# Altium project LifeLine.PrjPcb (part 1 of 2)
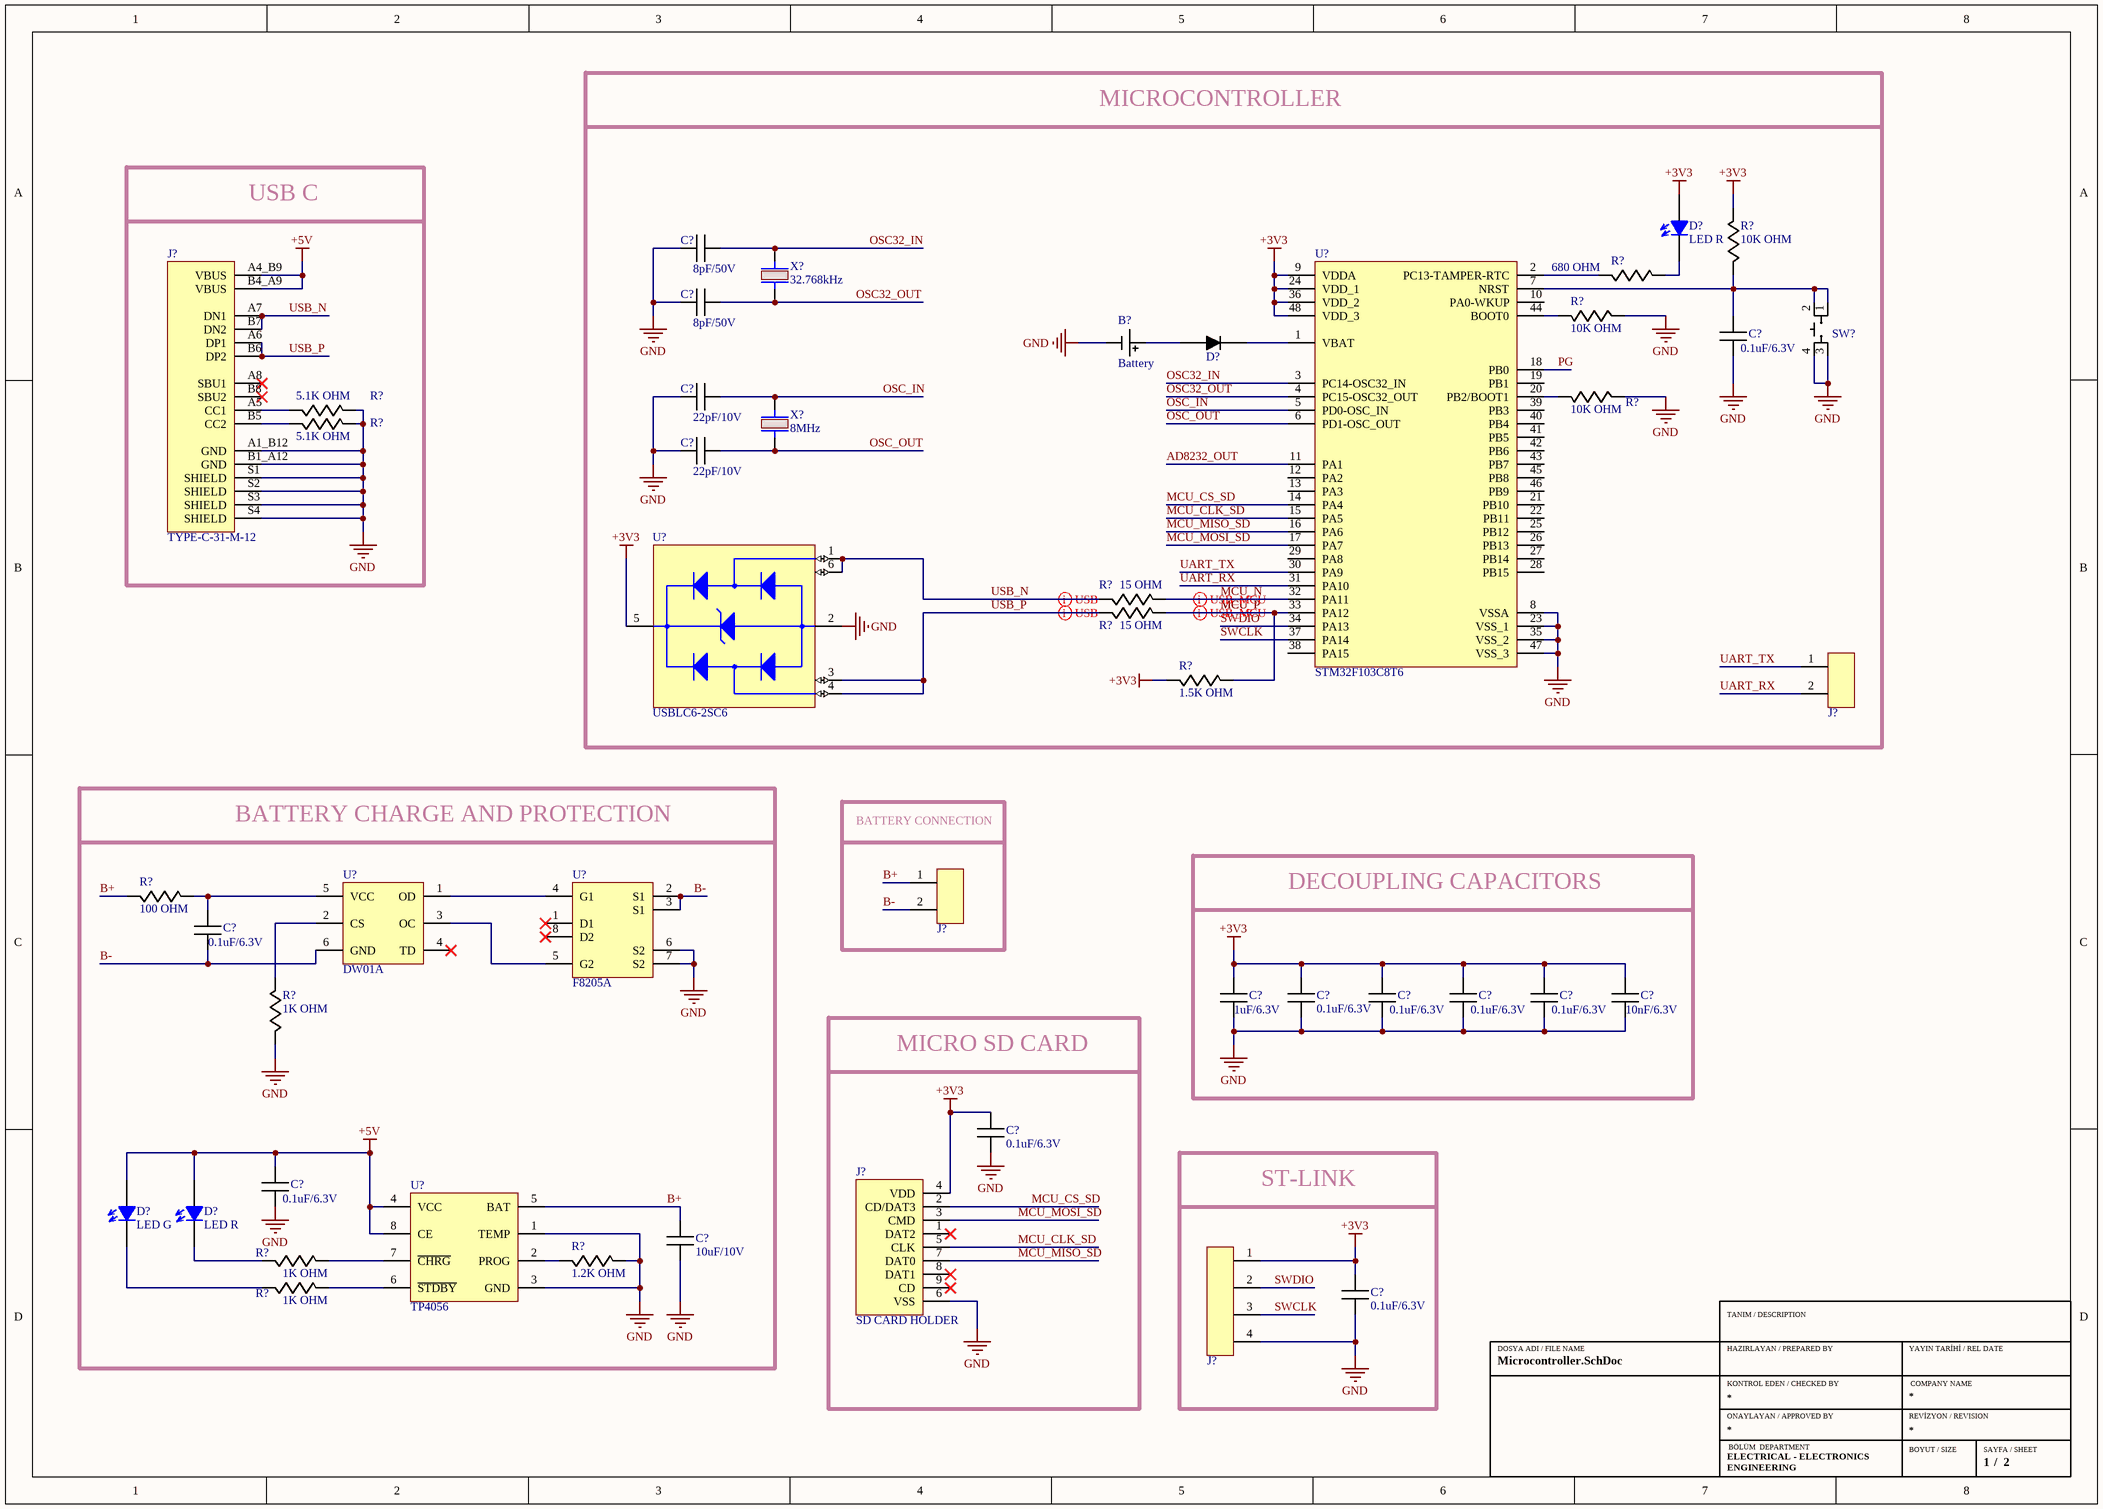
[diagram p0: Microcontroller.SchDoc]
2 sheets, 93 parts. Net scope: global (net labels, ports and power ports of the same name join across sheets).
Sheets:
  Microcontroller.SchDoc
  AD8232.SchDoc

## Sheet Microcontroller.SchDoc
size A3; SheetNumber: 1; SheetTotal: 2

### Parts
(Parts that share a designator on the sheet are numbered #1, #2 ... from top to bottom, then left to right.)
B?  Battery  [2032]
C?#1  8pF/50V  [CAP_0603]
C?#2  8pF/50V  [CAP_0603]
C?#3  0.1uF/6.3V  [CAP_0603]
C?#4  22pF/10V  [CAP 0805]
C?#5  22pF/10V  [CAP 0805]
C?#6  0.1uF/6.3V  [CAP_0603]
C?#7  1uF/6.3V  [CAP_0603]
C?#8  0.1uF/6.3V  [CAP_0603]
C?#9  0.1uF/6.3V  [CAP_0603]
C?#10  0.1uF/6.3V  [CAP_0603]
C?#11  0.1uF/6.3V  [CAP_0603]
C?#12  10nF/6.3V  [CAP_0603]
C?#13  0.1uF/6.3V  [CAP_0603]
C?#14  0.1uF/6.3V  [CAP_0603]
C?#15  10uF/10V  [CAP_0603]
C?#16  0.1uF/6.3V  [CAP_0603]
D?#1  LED R  [LED_RED_0805]
D?#2  DIODE SCHOTTKY 40V 1A SOD123  [SOD 123]  (value not drawn)
D?#3  LED G  [LED_GREEN_0805]
D?#4  LED R  [LED_RED_0805]
J?#1  TYPE-C-31-M-12  [USB]
J?#2  B2B-PH-SM4-TBT  [JST-2]  (value not drawn)
J?#3  BH-18650-PC  [1S BATTERY HOLDER]  (value not drawn)
J?#4  SD CARD HOLDER  [MICROSD - TF-115Y]
J?#5  4 Position Receptacle Connector 0.100" (2.54mm) Through Hole Gold  [HEADER X4]  (value not drawn)
R?#1  680 OHM  [RES_0603]
R?#2  10K OHM  [RES_0603]
R?#3  10K OHM  [RES_0603]
R?#4  10K OHM  [RES_0603]
R?#5  5.1K OHM  [RES 0805]
R?#6  5.1K OHM  [RES 0805]
R?#7  15 OHM  [RES 0805]
R?#8  15 OHM  [RES 0805]
R?#9  1.5K OHM  [RES_0603]
R?#10  100 OHM  [RES 0805]
R?#11  1K OHM  [RES 0805]
R?#12  1K OHM  [RES 0805]
R?#13  1.2K OHM  [RES 0805]
R?#14  1K OHM  [RES 0805]
SW?  TL3305BF260QG  [BUTTON]  (value not drawn)
U?#1  STM32F103C8T6  [LQFP48]
U?#2  USBLC6-2SC6  [SOT23-6]
U?#3  DW01A  [SOT23-6]
U?#4  F8205A  [TSSOP 8]
U?#5  TP4056  [ESOP-8]
X?#1  32.768kHz  [ABS07]
X?#2  8MHz  [ABLS]

### Blocks framed on the sheet
MICROCONTROLLER: B? C?#1-C?#5 D?#1 D?#2 J?#2 R?#1-R?#4 R?#7-R?#9 SW? U?#1 U?#2 X?#1 X?#2
USB C: J?#1 R?#5 R?#6
BATTERY CHARGE AND PROTECTION: C?#6 C?#14 C?#15 D?#3 D?#4 R?#10-R?#14 U?#3-U?#5
BATTERY CONNECTION: J?#3
DECOUPLING CAPACITORS: C?#7-C?#12
MICRO SD CARD: C?#13 J?#4
ST-LINK: C?#16 J?#5

### Nets
+3V3: C?#7.2 C?#8.2 C?#9.2 C?#10.2 C?#11.2 C?#12.2 C?#13.2 C?#16.2 D?#1.2 J?#4.4(VDD) J?#5.1 R?#2.2 R?#9.1 U?#1.9(VDDA) U?#1.24(VDD_1) U?#1.36(VDD_2) U?#1.48(VDD_3) U?#2.5(VBUS)
+5V: C?#14.2 D?#3.2 D?#4.2 J?#1.A4_B9(VBUS) J?#1.B4_A9(VBUS) U?#5.4(VCC) U?#5.8(CE)
GND: B?.2(-) C?#1.1 C?#2.1 C?#3.1 C?#4.2 C?#5.2 C?#7.1 C?#8.1 C?#9.1 C?#10.1 C?#11.1 C?#12.1 C?#13.1 C?#14.1 C?#15.1 C?#16.1 J?#1.A1_B12(GND) J?#1.B1_A12(GND) J?#1.S1(SHIELD) J?#1.S2(SHIELD) J?#1.S3(SHIELD) J?#1.S4(SHIELD) J?#4.6(VSS) J?#5.4 R?#3.1 R?#4.1 R?#5.2 R?#6.2 R?#11.1 R?#13.2 SW?.3 SW?.4 U?#1.8(VSSA) U?#1.23(VSS_1) U?#1.35(VSS_2) U?#1.47(VSS_3) U?#2.2(GND) U?#4.6(S2) U?#4.7(S2) U?#5.1(TEMP) U?#5.3(GND)
AD8232_OUT: U?#1.11(PA1)
B+: C?#15.2 J?#3.1 R?#10.1 U?#5.5(BAT)
B-: C?#6.2 J?#3.2 U?#3.6(GND) U?#4.2(S1) U?#4.3(S1)
MCU_CLK_SD: J?#4.5(CLK) U?#1.15(PA5)
MCU_CS_SD: J?#4.2(CD/DAT3) U?#1.14(PA4)
MCU_MISO_SD: J?#4.7(DAT0) U?#1.16(PA6)
MCU_MOSI_SD: J?#4.3(CMD) U?#1.17(PA7)
MCU_N: R?#7.2 U?#1.32(PA11)
MCU_P: R?#8.2 R?#9.2 U?#1.33(PA12)
OSC32_IN: C?#1.2 U?#1.3(PC14-OSC32_IN) X?#1.2
OSC32_OUT: C?#2.2 U?#1.4(PC15-OSC32_OUT) X?#1.1
OSC_IN: C?#4.1 U?#1.5(PD0-OSC_IN) X?#2.2
OSC_OUT: C?#5.1 U?#1.6(PD1-OSC_OUT) X?#2.1
PG: U?#1.18(PB0)
SWCLK: J?#5.3 U?#1.37(PA14)
SWDIO: J?#5.2 U?#1.34(PA13)
UART_RX: J?#2.2 U?#1.31(PA10)
UART_TX: J?#2.1 U?#1.30(PA9)
USB_N: J?#1.A7(DN1) J?#1.B7(DN2) R?#7.1 U?#2.1(I/O1_IN) U?#2.6(I/O1_OUT)
USB_P: J?#1.A6(DP1) J?#1.B6(DP2) R?#8.1 U?#2.3(I/O2_IN) U?#2.4(I/O2_OUT)
NetB?_1: B?.1(+) D?#2.A
NetC?#3_2: C?#3.2 R?#2.1 SW?.1 SW?.2 U?#1.7(NRST)
NetC?#6_1: C?#6.1 R?#10.2 U?#3.5(VCC)
NetD?#1_1: D?#1.1 R?#1.2
NetD?#2_C: D?#2.C U?#1.1(VBAT)
NetD?#3_1: D?#3.1 R?#14.1
NetD?#4_1: D?#4.1 R?#12.1
NetJ?#1_A5: J?#1.A5(CC1) R?#5.1
NetJ?#1_B5: J?#1.B5(CC2) R?#6.1
NetR?#1_1: R?#1.1 U?#1.2(PC13-TAMPER-RTC)
NetR?#3_2: R?#3.2 U?#1.44(BOOT0)
NetR?#4_2: R?#4.2 U?#1.20(PB2/BOOT1)
NetR?#11_2: R?#11.2 U?#3.2(CS)
NetR?#12_2: R?#12.2 U?#5.7(~{CHRG})
NetR?#13_1: R?#13.1 U?#5.2(PROG)
NetR?#14_2: R?#14.2 U?#5.6(~{STDBY})
NetU?#3_1: U?#3.1(OD) U?#4.4(G1)
NetU?#3_3: U?#3.3(OC) U?#4.5(G2)

Not connected (* = marked no-connect by the designer): J?#1 A8(SBU1)* B8(SBU2)*; J?#4 1(DAT2)* 8(DAT1)* 9(CD)*; U?#1 10(PA0-WKUP) 12(PA2) 13(PA3) 19(PB1) 21(PB10) 22(PB11) 25(PB12) 26(PB13) 27(PB14) 28(PB15) 29(PA8) 38(PA15) 39(PB3) 40(PB4) 41(PB5) 42(PB6) 43(PB7) 45(PB8) 46(PB9); U?#3 4(TD)*; U?#4 1(D1)* 8(D2)*

### Layout directives
differential pair: MCU_N, MCU_P, USB_N, USB_P

### Notes on the sheet
- TANIM / DESCRIPTION
- DOSYA ADI / FILE NAME
- HAZIRLAYAN / PREPARED BY
- KONTROL EDEN / CHECKED BY
- YAYIN TARİHİ / REL DATE
- COMPANY NAME
- ONAYLAYAN / APPROVED BY
- ELECTRICAL - ELECTRONICS
- BÖLÜM  DEPARTMENT
- BOYUT / SIZE
- REVİZYON / REVISION
- SAYFA / SHEET
- ENGINEERING
- /

### Library data of the parts
B? = Battery Holder: BATTERY HOLDER COIN 20MM SMD / Battery Holder (Open) Coin, 20.0mm 1 Cell SMD (SMT) Tab; ComponentLink1Description: datasheet; ComponentLink1URL: https://www.memoryprotectiondevices.com/datasheets/BU2032SM-JJ-MINI-GTR/BU2032SM-JJ-MINI-GTR-datasheet.pdf
C?#1 C?#2 = CAP CER 8pF: Multilayer Ceramic Capacitor, 8 pF, 50 V, ï¿½ 0.5 pF, C0G (NP0), 0603 [1608 Metric]; Manufacturer: Yageo; Manufacturer Part Number: CC0603DRNPO9BN8R0; Capacitance: 8pF; Voltage Rating: 50V; Supplier 1: Arrow Electronics; RoHS: Yes; Category: Ceramic Capacitors; Stock 1: 160000; Pricing 1: 4000=0,0112, 8000=0,01, 12000=0,0099, 28000=0,0093, 40000=0,0088, 100000=0,0087, 200000=0,0082, 400000=0,0079 (USD); Mount: Surface Mount; Case/Package: 0603; Case Code (Metric): 1608; Case Code (Imperial): 0603; Min Operating Temperature: -55°C; Max Operating Temperature: 125°C; Packaging: Tape and Reel; Package Quantity: 1; Voltage Rating (DC): 50V; Dielectric: C0G; Termination: SMD/SMT; Series: CC; Construction: Flat; Length: 1.6mm; Width: 0.031inch; Height: 0.8mm; Thickness: 0.035inch; RoHS Compliant: Yes; Halogen Free: 5694HalogenFree; Lead Free: 5697LeadFree; ComponentLink1URL: https://datasheet.ciiva.com/145/mlccorderingcode-145150.pdf?src-supplier=Digikey; ComponentLink1Description: https://datasheet.ciiva.com/145/mlccorderingcode-145150.pdf?src-supplier=Digikey; ComponentLink2URL: https://datasheet.ciiva.com/145/mlccorderingcode-145149.pdf?src-supplier=Digikey; ComponentLink2Description: https://datasheet.ciiva.com/145/mlccorderingcode-145149.pdf?src-supplier=Digikey; ComponentLink3URL: https://datasheet.ciiva.com/145/mlccorderingcode-145151.pdf?src-supplier=Digikey; ComponentLink3Description: https://datasheet.ciiva.com/145/mlccorderingcode-145151.pdf?src-supplier=Digikey; ComponentLink4URL: https://datasheet.ciiva.com/13386/upy-gp-np0-16v-to-50v-8-13386318.pdf?src-supplier=Mouser; ComponentLink4Description: https://datasheet.ciiva.com/13386/upy-gp-np0-16v-to-50v-8-13386318.pdf?src-supplier=Mouser; Supplier Part Number 1: CC0603DRNPO9BN8R0
C?#3 C?#6 C?#8-C?#11 C?#13 C?#14 C?#16 = CAP CER 0.1uF: Capacitor, Ceramic, 100Nf, 6.3Vdc, 10-% Tol, 10+% Tol, X7r-Tc Code, -15, 15%-Tc Rohs Compliant: Yes; Manufacturer: KEMET; Manufacturer Part Number: C0603C104K9RACTU; Dielectric Material: 4241ConductorMaterial; Voltage Rating: 6.3V; Tolerance: 10%; Dielectric: X7R; Dissipation Factor: 5%; Supplier 1: Digikey; RoHS: Yes; Category: Ceramic Capacitors; Stock 1: 82215; Pricing 1: 1=0,11, 10=0,066, 100=0,0429, 1000=0,0305 (USD); Mount: Surface Mount; Case/Package: 0603; Case Code (Imperial): 0603; Case Code (Metric): 1608; Material: 4241ConductorMaterial; Min Operating Temperature: -55°C; Max Operating Temperature: 125°C; Capacitance: 100nF; Package Quantity: 4000; Packaging: Tape and Reel; Voltage Rating (DC): 6.3V; Termination: SMD/SMT; Series: C; Construction: Flat; Length: 1.6mm; Width: 0.8mm; Height: 0.8mm; Thickness: 0.034inch; Depth: 0.8mm; Radiation Hardening: No; RoHS Compliant: Yes; ComponentLink1URL: https://datasheet.ciiva.com/13371/kem-c1002-x7r-smd-357932-13371879.pdf?src-supplier=Mouser; ComponentLink1Description: https://datasheet.ciiva.com/13371/kem-c1002-x7r-smd-357932-13371879.pdf?src-supplier=Mouser; Supplier Part Number 1: 399-15351-1-ND
C?#4 C?#5 = CAP CER 22pF: Cap Ceramic 22pF 10V C0G 5% Pad SMD 0805 125C T/R; Manufacturer: Wurth Electronics; Manufacturer Part Number: 885012007002; Insulation Resistance: 10GR; Supplier 1: Mouser; RoHS: Yes; Category: Ceramic Capacitors; Stock 1: 11792; Pricing 1: 1=0,1, 10=0,053, 50=0,053, 100=0,046, 1000=0,041, 10000=0,034 (USD); Voltage Rating (DC): 10V; Height: 600um; ComponentLink1URL: http://www.farnell.com/datasheets/2031682.pdf?src-supplier=Farnell; ComponentLink1Description: http://www.farnell.com/datasheets/2031682.pdf?src-supplier=Farnell; ComponentLink2URL: https://katalog.we-online.de/pbs/datasheet/885012007002.pdf?src-supplier=Digikey; ComponentLink2Description: https://katalog.we-online.de/pbs/datasheet/885012007002.pdf?src-supplier=Digikey; Supplier Part Number 1: 710-885012007002
C?#7 = CAP CER 1uF: Multilayer Ceramic Capacitor, 1 uF, 6.3 V, ± 10%, X5R, 0603 [1608 Metric]; Manufacturer: KEMET; Manufacturer Part Number: C0603C105K9PAC7411; Capacitance: 1uF; Voltage Rating (DC): 6.3V; Supplier 1: Arrow Electronics; RoHS: Yes; Category: Ceramic Capacitors; Stock 1: 10; Pricing 1: 1=0,043, 10=0,0049 (USD); Mount: Surface Mount; Case/Package: 0603; Dielectric Material: Ceramic; Min Operating Temperature: -55°C; Max Operating Temperature: 85°C; Tolerance: 10%; Packaging: Tape and Reel; Dielectric: X5R; Construction: Flat; Series: SMD Comm X5R; Voltage Rating: 6.3V; Length: 1.6mm; Height: 0.8mm; Depth: 0.8mm; Radiation Hardening: No; Lead Free: Lead Free; RoHS Compliant: Yes; ComponentLink1URL: http://capacitoredge.kemet.com/capedge2/DataSheet?pn=C0603C105K9PAC7411&src-supplier=Avnet; ComponentLink1Description: http://capacitoredge.kemet.com/capedge2/DataSheet?pn=C0603C105K9PAC7411&src-supplier=Avnet; Supplier Part Number 1: C0603C105K9PAC7411
C?#12 = CAP CER 10nF: Capacitor, Ceramic, 10Nf, 6.3Vdc, 10-% Tol, 10+% Tol, X7r-Tc Code, -15, 15%-Tc Rohs Compliant: Yes; Manufacturer: KEMET; Manufacturer Part Number: C0603C103K9RACTU; Tolerance: 10%; Voltage Rating: 6.3V; Dielectric: X7R; Dissipation Factor: 5%; Supplier 1: Digikey; RoHS: Yes; Category: Ceramic Capacitors; Stock 1: 43180; Pricing 1: 1=0,1, 10=0,048, 100=0,0311, 1000=0,02155 (USD); Mount: Surface Mount; Case/Package: 0603; Case Code (Metric): 1608; Case Code (Imperial): 0603; Dielectric Material: Ceramic; Material: Ceramic; Min Operating Temperature: -55°C; Max Operating Temperature: 125°C; Capacitance: 10nF; Package Quantity: 1; Packaging: Tape and Reel; Voltage Rating (DC): 6.3V; Termination: SMD/SMT; Series: C; Construction: Flat; Length: 1.6mm; Width: 0.031inch; Height: 0.8mm; Thickness: 0.034inch; Depth: 0.8mm; Radiation Hardening: No; RoHS Compliant: Yes; ComponentLink1URL: https://datasheet.ciiva.com/5421/kem-c1002-x7r-smd-357932-5421815.pdf?src-supplier=Mouser; ComponentLink1Description: https://datasheet.ciiva.com/5421/kem-c1002-x7r-smd-357932-5421815.pdf?src-supplier=Mouser; Supplier Part Number 1: 399-C0603C103K9RACTUDKR-ND
C?#15 = CAP CER 10uF: Multilayer Ceramic Capacitor, 10 uF, 10 V, ï¿½ 20%, X5R, 0603 [1608 Metric]; Manufacturer: Murata; Manufacturer Part Number: GRM188R61A106ME69D; Capacitance: 10uF; Voltage Rating: 10V; Supplier 1: Digikey; RoHS: Yes; Category: Ceramic Capacitors; Stock 1: 92548; Pricing 1: 1=0,12, 10=0,068, 100=0,0409, 1000=0,02707 (USD); Mount: Surface Mount; Case/Package: 0603; Number of Pins: 2NUMBER; Case Code (Metric): 1608; Case Code (Imperial): 0603; Material: Ceramic; Weight: 0.000222oz; Min Operating Temperature: -55°C; Max Operating Temperature: 85°C; Packaging: Tape and Reel; Tolerance: 20%; Dielectric: X5R; Termination: SMD/SMT; Voltage Rating (DC): 10V; Package Quantity: 4000; Series: GRM; Length: 1.6mm; Width: 0.8mm; Height: 0.8mm; Thickness: 0.035inch; Lead Free: Lead Free; RoHS Compliant: Yes; Reach SVHC Compliant: Unknown; ComponentLink1URL: http://www.farnell.com/datasheets/1872210.pdf?src-supplier=Farnell; ComponentLink1Description: http://www.farnell.com/datasheets/1872210.pdf?src-supplier=Farnell; ComponentLink2URL: http://www.mouser.com/ds/2/281/c02e-2905.pdf?src-supplier=Mouser; ComponentLink2Description: http://www.mouser.com/ds/2/281/c02e-2905.pdf?src-supplier=Mouser; ComponentLink3URL: http://www.farnell.com/datasheets/1872210.pdf?src-supplier=Newark; ComponentLink3Description: http://www.farnell.com/datasheets/1872210.pdf?src-supplier=Newark; ComponentLink4URL: https://datasheet.octopart.com/GRM188R61A106ME69D-Murata-datasheet-22122223.pdf?src-supplier=Future+Electronics; ComponentLink4Description: https://datasheet.octopart.com/GRM188R61A106ME69D-Murata-datasheet-22122223.pdf?src-supplier=Future+Electronics; ComponentLink5URL: http://search.murata.co.jp/Ceramy/image/img/A01X/G101/ENG/GRM188R61A106ME69-01.pdf?src-supplier=Digikey; ComponentLink5Description: http://search.murata.co.jp/Ceramy/image/img/A01X/G101/ENG/GRM188R61A106ME69-01.pdf?src-supplier=Digikey; ComponentLink6URL: http://www.farnell.com/datasheets/2048014.pdf?src-supplier=Element14; ComponentLink6Description: http://www.farnell.com/datasheets/2048014.pdf?src-supplier=Element14; ComponentLink7URL: https://datasheet.octopart.com/GRM188R61A106ME69D-Murata-datasheet-62317187.pdf?src-supplier=Element14; ComponentLink7Description: https://datasheet.octopart.com/GRM188R61A106ME69D-Murata-datasheet-62317187.pdf?src-supplier=Element14; ComponentLink8URL: http://www.farnell.com/datasheets/1872210.pdf?src-supplier=Element14; ComponentLink8Description: http://www.farnell.com/datasheets/1872210.pdf?src-supplier=Element14; ComponentLink9URL: https://datasheet.octopart.com/GRM188R61A106ME69D-Murata-datasheet-165579666.pdf?src-supplier=TME; ComponentLink9Description: https://datasheet.octopart.com/GRM188R61A106ME69D-Murata-datasheet-165579666.pdf?src-supplier=TME; Supplier Part Number 1: 490-10475-1-ND
D?#1 D?#4 = LED RED 0805: Led, Red, 630 Nm, 1.9 V, 30 Ma, 60 Mcd Rohs Compliant: Yes |Wurth Elektronik 150080SS75000; Manufacturer: Wurth Electronics; Lens Color: Colorless; Luminous Intensity: 60mcd; Forward Current: 30mA; Forward Voltage: 1.9V; Viewing Angle: 140°; Wavelength: 630nm; Lens Style: Clear,Flat,Rectangular; Test Current: 20mA; Lens Transparency: Clear; Max Reverse Voltage (DC): 5V; Power Dissipation: 72mW; Lens Size: 1.25mm; Supplier 1: Mouser; Manufacturer Part Number: 150080SS75000; RoHS: Yes; Category: LEDs; Stock 1: 9598; Pricing 1: 1=0,19, 10=0,187, 50=0,176, 100=0,151, 1000=0,138, 10000=0,138 (USD); Mount: Surface Mount; Case/Package: 0805; Color: Red; Case Code (Metric): 2012; Case Code (Imperial): 0805; Min Operating Temperature: -40°C; Max Operating Temperature: 85°C; Package Quantity: 1; Packaging: Cut Tape; Dominant Wavelength: 630nm; Series: WL-SMCW; Reverse Voltage: 5V; Length: 2mm; Width: 1.25mm; Height: 0.8mm; RoHS Compliant: Yes; Reach SVHC Compliant: Unknown; ComponentLink1URL: https://datasheet.ciiva.com/22656/150080ss75000-22656963.pdf?src-supplier=Element14; ComponentLink1Description: https://datasheet.ciiva.com/22656/150080ss75000-22656963.pdf?src-supplier=Element14; ComponentLink2URL: https://datasheet.ciiva.com/29279/759436-da-01-en-chipled-0805-w-kl-s-rot-150080ss75000-29279211.pdf?src-supplier=Conrad; ComponentLink2Description: https://datasheet.ciiva.com/29279/759436-da-01-en-chipled-0805-w-kl-s-rot-150080ss75000-29279211.pdf?src-supplier=Conrad; ComponentLink3URL: https://datasheet.ciiva.com/29563/150080ss75000-29563014.pdf?src-supplier=Digikey; ComponentLink3Description: https://datasheet.ciiva.com/29563/150080ss75000-29563014.pdf?src-supplier=Digikey; ComponentLink4URL: https://datasheet.ciiva.com/29563/150080ss75000-29563013.pdf?src-supplier=Digikey; ComponentLink4Description: https://datasheet.ciiva.com/29563/150080ss75000-29563013.pdf?src-supplier=Digikey; ComponentLink5URL: https://datasheet.ciiva.com/29563/150080ss75000-29563015.pdf?src-supplier=Digikey; ComponentLink5Description: https://datasheet.ciiva.com/29563/150080ss75000-29563015.pdf?src-supplier=Digikey; Supplier Part Number 1: 710-150080SS75000
D?#2 = DIODE SCHOTTKY 40V 1A: 1N5819HW Series 40 V 1 A Surface Mount Schottky Barrier Rectifier - SOD-123; Manufacturer: Diodes; Manufacturer Part Number: 1N5819HW-7-F; Max Reverse Current: 50uA; Max Forward Surge Current (Ifsm): 25A; Forward Voltage: 450mV; Max Power Dissipation: 450mW; Polarity: Standard; Capacitance: 50pF; Supplier 1: Arrow Electronics; RoHS: Yes; Category: Schottky Diodes; Stock 1: 1971000; Pricing 1: 3000=0,0529, 6000=0,0453, 9000=0,0417 (USD); Case/Package: SOD-123-2; Number of Pins: 2; Weight: 0.000353oz; Min Operating Temperature: -65°C; Max Operating Temperature: 125°C; Forward Current: 1A; Max Repetitive Reverse Voltage (Vrrm): 40V; Packaging: Tape and Reel; Peak Non-Repetitive Surge Current: 25A; Package Quantity: 3000; Average Rectified Current: 1A; Termination: SMD/SMT; Voltage Rating (DC): 40V; Current Rating: 1A; Output Current: 1A; Max Reverse Voltage (DC): 40V; Series: -; Reverse Voltage: 40V; Length: 2.85mm; Width: 1.7mm; Height: 1.25mm; Radiation Hardening: No; RoHS Compliant: Yes; Reach SVHC Compliant: No; Lead Free: Lead Free; ComponentLink1URL: https://datasheet.ciiva.com/27092/1538419-27092484.pdf?src-supplier=Jameco; ComponentLink1Description: https://datasheet.ciiva.com/27092/1538419-27092484.pdf?src-supplier=Jameco; ComponentLink2URL: https://datasheet.ciiva.com/16303/ds30217-16303296.pdf?src-supplier=Future+Electronics; ComponentLink2Description: https://datasheet.ciiva.com/16303/ds30217-16303296.pdf?src-supplier=Future+Electronics; ComponentLink3URL: https://datasheet.ciiva.com/1177/ds30217-1177089.pdf?src-supplier=Element14; ComponentLink3Description: https://datasheet.ciiva.com/1177/ds30217-1177089.pdf?src-supplier=Element14; ComponentLink4URL: https://datasheet.ciiva.com/8303/ds30217-8303132.pdf?src-supplier=Avnet; ComponentLink4Description: https://datasheet.ciiva.com/8303/ds30217-8303132.pdf?src-supplier=Avnet; ComponentLink5URL: https://datasheet.ciiva.com/912/ds30217-912802.pdf?src-supplier=Digikey; ComponentLink5Description: https://datasheet.ciiva.com/912/ds30217-912802.pdf?src-supplier=Digikey; ComponentLink6URL: https://datasheet.ciiva.com/912/ds30217-912803.pdf?src-supplier=Digikey; ComponentLink6Description: https://datasheet.ciiva.com/912/ds30217-912803.pdf?src-supplier=Digikey; ComponentLink7URL: https://datasheet.ciiva.com/912/ds30217-912801.pdf?src-supplier=Digikey; ComponentLink7Description: https://datasheet.ciiva.com/912/ds30217-912801.pdf?src-supplier=Digikey; Supplier Part Number 1: 1N5819HW-7-F
D?#3 = LED GREEN 0805: XL-2012SYGC / Green 570nm LED Indication - Discrete 2.1V 0805 (2012 Metric)
J?#1 = USB - TYPE-C-31-M-12
J?#2 = JST-2: Connector Header Ph Series 2 Position 2.00MM 100V Surface Mount Solder Pick And Place Natural.; Manufacturer: JST; Manufacturer Part Number: B2B-PH-SM4-TBT(LF)(SN); Number of Contacts: 2NUMBER; Supplier 1: Arrow Electronics; RoHS: Yes; Category: Headers and Wire Housings; Stock 1: 101000; Pricing 1: 1000=0,3158, 2000=0,3109, 3000=0,3059, 4000=0,3038, 5000=0,296, 10000=0,2938 (USD); Orientation: 5495OrientationType; Height: 6.65mm; Lead Free: 5697LeadFree; ComponentLink1URL: https://datasheet.ciiva.com/26894/getdatasheetpartid-473167-26894757.pdf?src-supplier=Verical; ComponentLink1Description: https://datasheet.ciiva.com/26894/getdatasheetpartid-473167-26894757.pdf?src-supplier=Verical; ComponentLink2URL: https://datasheet.ciiva.com/732/eph-732907.pdf?src-supplier=Digikey; ComponentLink2Description: https://datasheet.ciiva.com/732/eph-732907.pdf?src-supplier=Digikey; ComponentLink3URL: https://datasheet.ciiva.com/14800/eph-14800607.pdf?src-supplier=Digikey; ComponentLink3Description: https://datasheet.ciiva.com/14800/eph-14800607.pdf?src-supplier=Digikey; Supplier Part Number 1: B2B-PH-SM4-TBT(LF)(SN)
J?#3 = 1S BATTERY HOLDER: Battery Holder (Open) 18650 1 Cell PC Pin; ComponentLink1Description: purchasing; ComponentLink1URL: https://www.digikey.com/en/products/detail/mpd-memory-protection-devices/BH-18650-PC/3029216
J?#4 = SD CARD CONNECTOR: XUNPU TF-115Y-ACP9
J?#5 = Header x4: Conn Socket Strip SKT 4 POS 2.54mm Solder ST Top Entry Thru-Hole Tube; Manufacturer: Samtec; Manufacturer Part Number: SSW-104-02-G-S; Supplier 1: Avnet; RoHS: Yes; Category: Connectors; Stock 1: 1239; Pricing 1: 1=0,822, 10=0,81, 30=0,792, 50=0,762, 100=0,738 (USD); ComponentLink1URL: https://datasheet.ciiva.com/25617/0900766b8115c03d-25617503.pdf?src-supplier=Rs; ComponentLink1Description: https://datasheet.ciiva.com/25617/0900766b8115c03d-25617503.pdf?src-supplier=Rs; ComponentLink2URL: https://datasheet.ciiva.com/22677/82032-22677625.pdf?src-supplier=Element14; ComponentLink2Description: https://datasheet.ciiva.com/22677/82032-22677625.pdf?src-supplier=Element14; ComponentLink3URL: https://datasheet.ciiva.com/750/ssw-1xx-xx-xxx-x-xx-xxx-xx-mkt-750222.pdf?src-supplier=Digikey; ComponentLink3Description: https://datasheet.ciiva.com/750/ssw-1xx-xx-xxx-x-xx-xxx-xx-mkt-750222.pdf?src-supplier=Digikey; Supplier Part Number 1: SSW-104-02-G-S
R?#1 = RES 680 OHM 0603 - L: SMD Chip Resistor, 680 Ohm, ± 1%, 250 mW, 0603 [1608 Metric], Thick Film, Anti-Surge; Manufacturer: Vishay Dale; Manufacturer Part Number: RCS0603680RFKEA; Resistance: 680R; Max Power Dissipation: 250mW; Temperature Coefficient: 100ppm/°C; Supplier 1: Mouser; RoHS: Yes; Category: Chip SMD Resistors; Stock 1: 15852; Pricing 1: 1=0,13, 10=0,066, 50=0,066, 100=0,035, 1000=0,022, 10000=0,015 (USD); Case/Package: 0603; Case Code (Imperial): 0603; Case Code (Metric): 1608; Min Operating Temperature: -55°C; Max Operating Temperature: 155°C; Package Quantity: 5000; Packaging: Tape and Reel; Number of Terminations: 2; Tolerance: 1%; Features: Automotive AEC-Q200; Series: RCS e3; Length: 0.061inch; Width: 0.033inch; Height: 0.02inch; Ratings: AEC-Q200; RoHS Compliant: Yes; ComponentLink1URL: http://www.vishay.com/docs/20065/rcse3.pdf?src-supplier=Digikey; ComponentLink1Description: http://www.vishay.com/docs/20065/rcse3.pdf?src-supplier=Digikey; Supplier Part Number 1: 71-RCS0603680RFKEA
R?#2-R?#4 = RES 10K OHM 0603: SMD Chip Resistor, 10 kOhm, ï¿½ 1%, 100 mW, 0603 [1608 Metric], Thick Film, General Purpose; Manufacturer: Yageo; Manufacturer Part Number: RC0603FR-0710KL; Temperature Coefficient: 100ppm/°C; Voltage Rating (DC): 50V; Power Rating: 100mW; Voltage Rating: 75V; Resistance: 10kR; Supplier 1: Digi-Key; RoHS: Yes; Category: Chip SMD Resistors; Stock 1: 43901522; Pricing 1: 1=0,10000, 10=0,02200, 100=0,00890, 1000=0,00402, 2500=0,00349 (USD); Case/Package: 0603; Number of Pins: 2; Case Code (Imperial): 0603; Case Code (Metric): 1608; Weight: 7.1E-05oz; Size Code: 0603; Min Operating Temperature: -55°C; Max Operating Temperature: 155°C; Tolerance: 1%; Resistor Type: Thick Film; Packaging: Tape and Reel; Termination: SMD/SMT; Features: Moisture Resistant; Series: RC; Max Power Dissipation: 100mW; Number of Terminations: 2; Resistance Tolerance: 1%; Construction: Rectangular; Length: 1.6mm; Width: 0.8mm; Height: 0.45mm; Depth: 0.8mm; Lead Pitch: 0.3mm; REACH SVHC: Unknown; Lead Free: Lead Free; Military Standard: Not; RoHS Compliant: Yes; ComponentLink1URL: https://datasheet.ciiva.com/7660/38590-7660789.pdf?src-supplier=Element14; ComponentLink1Description: https://datasheet.ciiva.com/7660/38590-7660789.pdf?src-supplier=Element14; ComponentLink2URL: https://datasheet.ciiva.com/7983/443971-7983596.pdf?src-supplier=Element14; ComponentLink2Description: https://datasheet.ciiva.com/7983/443971-7983596.pdf?src-supplier=Element14; ComponentLink3URL: https://datasheet.ciiva.com/22747/443971-22747519.pdf?src-supplier=Element14; ComponentLink3Description: https://datasheet.ciiva.com/22747/443971-22747519.pdf?src-supplier=Element14; ComponentLink4URL: https://datasheet.ciiva.com/46440/1868787-46440891.pdf?src-supplier=Element14; ComponentLink4Description: https://datasheet.ciiva.com/46440/1868787-46440891.pdf?src-supplier=Element14; ComponentLink5URL: https://datasheet.ciiva.com/7746/1738695-7746239.pdf?src-supplier=Element14; ComponentLink5Description: https://datasheet.ciiva.com/7746/1738695-7746239.pdf?src-supplier=Element14; ComponentLink6URL: https://datasheet.ciiva.com/15189/getdatasheetpartid-409289-15189591.pdf?src-supplier=Verical; ComponentLink6Description: https://datasheet.ciiva.com/15189/getdatasheetpartid-409289-15189591.pdf?src-supplier=Verical; Supplier Part Number 1: 311-10.0KHRCT-ND; Supplier 2: Digikey; Stock 2: 3432908; Pricing 2: 1=0,1, 10=0,009, 100=0,0071, 1000=0,00612, 2500=0,00461 (USD); Reach SVHC Compliant: No; Supplier Part Number 2: 311-10.0KHRDKR-ND
R?#5 R?#6 = RES 5.1K OHM 0805: 125Mw Thick Film Resistors 100Ppm/ 1% 5.1K 0805 Chip Resistor Surface Mount Rohs; Manufacturer: Yageo; Manufacturer Part Number: RC0805FR-075K1L; Voltage Rating: 150V; Resistance: 5.1kR; Temperature Coefficient: 100ppm/°C; Supplier 1: Future Electronics; RoHS: Yes; Category: Chip SMD Resistors; Stock 1: 1085000; Pricing 1: 5000=0,0018, 25000=0,0017, 125000=0,0016, 375000=0,0016, 1000000=0,0015 (USD); Mount: Surface Mount; Case/Package: 0805; Case Code (Metric): 2012; Case Code (Imperial): 0805; Min Operating Temperature: -55°C; Max Operating Temperature: 155°C; Packaging: Tape and Reel; Termination: SMD/SMT; Package Quantity: 1; Power Rating: 125mW; Tolerance: 1%; Number of Terminations: 2; Max Power Dissipation: 125mW; Voltage Rating (DC): 150V; Features: Moisture Resistant; Series: RC; Technology: THICK FILM; Construction: Rectangular; Length: 0.079inch; Width: 0.049inch; Height: 0.024inch; Depth: 1.25mm; RoHS Compliant: Yes; Lead Free: 5697LeadFree; Military Standard: Not; ComponentLink1URL: https://datasheet.ciiva.com/11808/0900766b8106beab-11808171.pdf?src-supplier=Rs; ComponentLink1Description: https://datasheet.ciiva.com/11808/0900766b8106beab-11808171.pdf?src-supplier=Rs; ComponentLink2URL: https://datasheet.ciiva.com/2456/pyu-r-int-thick-7-2456979.pdf?src-supplier=Digikey; ComponentLink2Description: https://datasheet.ciiva.com/2456/pyu-r-int-thick-7-2456979.pdf?src-supplier=Digikey; ComponentLink3URL: https://datasheet.ciiva.com/2456/pyu-r-int-thick-7-2456980.pdf?src-supplier=Digikey; ComponentLink3Description: https://datasheet.ciiva.com/2456/pyu-r-int-thick-7-2456980.pdf?src-supplier=Digikey; ComponentLink4URL: https://datasheet.ciiva.com/2456/pyu-r-int-thick-7-2456978.pdf?src-supplier=Digikey; ComponentLink4Description: https://datasheet.ciiva.com/2456/pyu-r-int-thick-7-2456978.pdf?src-supplier=Digikey; ComponentLink5URL: https://datasheet.ciiva.com/5558/rc0805-5558152.pdf?src-supplier=Mouser; ComponentLink5Description: https://datasheet.ciiva.com/5558/rc0805-5558152.pdf?src-supplier=Mouser; Supplier Part Number 1: 5647425
R?#7 R?#8 = RES 15 OHM 0805: SMD Chip Resistor, 15 Ohm, ± 1%, 125 mW, 0805 [2012 Metric], Thick Film, General Purpose; Manufacturer: Yageo; Manufacturer Part Number: RC0805FR-0715RL; Voltage Rating (AC): 150V; Supplier 1: Avnet; RoHS: Yes; Category: Chip SMD Resistors; Stock 1: 4450; Pricing 1: 1=0,104, 25=0,017, 50=0,014, 100=0,009 (USD); ComponentLink1URL: https://datasheet.ciiva.com/11809/0900766b8106beab-11809362.pdf?src-supplier=Rs; ComponentLink1Description: https://datasheet.ciiva.com/11809/0900766b8106beab-11809362.pdf?src-supplier=Rs; ComponentLink2URL: https://datasheet.ciiva.com/2491/pyu-r-int-thick-7-2491555.pdf?src-supplier=Digikey; ComponentLink2Description: https://datasheet.ciiva.com/2491/pyu-r-int-thick-7-2491555.pdf?src-supplier=Digikey; ComponentLink3URL: https://datasheet.ciiva.com/2491/pyu-r-int-thick-7-2491556.pdf?src-supplier=Digikey; ComponentLink3Description: https://datasheet.ciiva.com/2491/pyu-r-int-thick-7-2491556.pdf?src-supplier=Digikey; ComponentLink4URL: https://datasheet.ciiva.com/2491/pyu-r-int-thick-7-2491557.pdf?src-supplier=Digikey; ComponentLink4Description: https://datasheet.ciiva.com/2491/pyu-r-int-thick-7-2491557.pdf?src-supplier=Digikey; ComponentLink5URL: https://datasheet.ciiva.com/7941/444164-7941703.pdf?src-supplier=Element14; ComponentLink5Description: https://datasheet.ciiva.com/7941/444164-7941703.pdf?src-supplier=Element14; ComponentLink6URL: https://datasheet.ciiva.com/7941/444164-7941704.pdf?src-supplier=Element14; ComponentLink6Description: https://datasheet.ciiva.com/7941/444164-7941704.pdf?src-supplier=Element14; ComponentLink7URL: https://datasheet.ciiva.com/5990/1686128-5990063.pdf?src-supplier=Farnell; ComponentLink7Description: https://datasheet.ciiva.com/5990/1686128-5990063.pdf?src-supplier=Farnell; ComponentLink8URL: https://datasheet.ciiva.com/12668/rc0805-12668247.pdf?src-supplier=Mouser; ComponentLink8Description: https://datasheet.ciiva.com/12668/rc0805-12668247.pdf?src-supplier=Mouser; Supplier Part Number 1: 49AK3070
R?#9 = RES 1.5K OHM 0603 - L: Res Thick Film 0603 1.5K Ohm 1% 0.25W(1/4W) ±100ppm/C Pad SMD Automotive Medical T/R; Manufacturer: Vishay Dale; Manufacturer Part Number: RCS06031K50FKEA; Resistance: 1.5kR; Max Power Dissipation: 250mW; Temperature Coefficient: 100ppm/°C; Supplier 1: Mouser; RoHS: Yes; Category: Chip SMD Resistors; Stock 1: 47553; Pricing 1: 1=0,14, 10=0,06, 50=0,06, 100=0,034, 1000=0,021, 10000=0,015 (USD); Case/Package: 0603; Case Code (Metric): 1608; Case Code (Imperial): 0603; Min Operating Temperature: -55°C; Max Operating Temperature: 155°C; Packaging: Cut Tape; Number of Terminations: 2; Tolerance: 1%; Features: Automotive AEC-Q200; Series: RCS e3; Ratings: AEC-Q200; ComponentLink1URL: http://www.vishay.com/docs/20065/rcse3.pdf?src-supplier=Digikey; ComponentLink1Description: http://www.vishay.com/docs/20065/rcse3.pdf?src-supplier=Digikey; Supplier Part Number 1: 71-RCS06031K50FKEA
R?#10 = RES 100 OHM 0805: Res Thick Film 0805 100 Ohm 1% 0.5W(1/2W) +/-100ppm/C Pad SMD Automotive T/R; Manufacturer: Vishay Dale; Manufacturer Part Number: CRCW0805100RFKEAHP; Voltage Rating (DC): 150V; Supplier 1: Mouser; RoHS: Yes; Category: Chip SMD Resistors; Stock 1: 108057; Pricing 1: 1=0,18, 10=0,061, 50=0,061, 100=0,052, 1000=0,033, 10000=0,022 (USD); Lead Free: 5697LeadFree; RoHS Compliant: 5897YesNo; Supplier Part Number 1: 71-CRCW0805100RFKEAH
R?#11 R?#12 R?#14 = RES 1K OHM 0805: Res Thick Film 0805 1K Ohm 1% 0.125W(1/8W) ±100ppm/C Pad SMD T/R Automotive AEC-Q200; Manufacturer: Yageo; Manufacturer Part Number: AC0805FR-071KL; Resistance: 1kR; Power Rating: 125mW; Voltage Rating: 150V; Temperature Coefficient: 100ppm/°C; Supplier 1: Future Electronics; RoHS: Yes; Category: Chip SMD Resistors; Stock 1: 545000; Pricing 1: 5000=0,0023, 25000=0,0022, 125000=0,0021, 250000=0,002, 750000=0,0019 (USD); Case/Package: 0805; Case Code (Imperial): 0805; Case Code (Metric): 2012; Min Operating Temperature: -55°C; Max Operating Temperature: 155°C; Tolerance: 1%; Packaging: Tape and Reel; Termination: SMD/SMT; Number of Terminations: 2; Max Power Dissipation: 125mW; Features: Moisture Resistant,Automotive AEC-Q200; Series: AC; Construction: Rectangular; Length: 2mm; Width: 1.25mm; Height: 0.024inch; Depth: 1.25mm; Military Standard: Not; Lead Free: Lead Free; RoHS Compliant: Yes; ComponentLink1URL: https://datasheet.ciiva.com/26829/getdatasheetpartid-732555-26829222.pdf?src-supplier=Verical; ComponentLink1Description: https://datasheet.ciiva.com/26829/getdatasheetpartid-732555-26829222.pdf?src-supplier=Verical; Supplier Part Number 1: 3029305
R?#13 = RES 1.2K OHM 0805: SMD Chip Resistor, 1.2 kOhm, ï¿½ 5%, 125 mW, 0805 [2012 Metric], Thick Film, General Purpose; Manufacturer: Yageo; Manufacturer Part Number: RC0805JR-071K2L; Voltage Rating (AC): 150V; Supplier 1: Future Electronics; RoHS: Yes; Category: Chip SMD Resistors; Stock 1: 545000; Pricing 1: 5000=0,0014, 25000=0,0013, 125000=0,0012, 500000=0,0012, 1250000=0,0011 (USD); Lead Free: 5697LeadFree; ComponentLink1URL: https://datasheet.ciiva.com/5558/rc0805-5558200.pdf?src-supplier=Mouser; ComponentLink1Description: https://datasheet.ciiva.com/5558/rc0805-5558200.pdf?src-supplier=Mouser; ComponentLink2URL: https://datasheet.ciiva.com/2456/pyu-r-int-thick-7-2456079.pdf?src-supplier=Digikey; ComponentLink2Description: https://datasheet.ciiva.com/2456/pyu-r-int-thick-7-2456079.pdf?src-supplier=Digikey; ComponentLink3URL: https://datasheet.ciiva.com/2456/pyu-r-int-thick-7-2456080.pdf?src-supplier=Digikey; ComponentLink3Description: https://datasheet.ciiva.com/2456/pyu-r-int-thick-7-2456080.pdf?src-supplier=Digikey; ComponentLink4URL: https://datasheet.ciiva.com/2456/pyu-r-int-thick-7-2456081.pdf?src-supplier=Digikey; ComponentLink4Description: https://datasheet.ciiva.com/2456/pyu-r-int-thick-7-2456081.pdf?src-supplier=Digikey; Supplier Part Number 1: 6518609
SW? = Button: Switch Tactile N.O. SPST Round Button Gull Wing 0.05A 12VDC 2.55N SMD T/R; Manufacturer: E-Switch; Supplier 1: Mouser; Manufacturer Part Number: TL3305BF260QG; RoHS: Yes; Category: Tactile Switches; Stock 1: 16255; Pricing 1: 1=0,21, 10=0,174, 50=0,174, 100=0,16, 1000=0,145, 10000=0,088 (USD); ComponentLink1URL: http://www.farnell.com/datasheets/2554191.pdf?src-supplier=Farnell; ComponentLink1Description: http://www.farnell.com/datasheets/2554191.pdf?src-supplier=Farnell; ComponentLink2URL: https://datasheet.octopart.com/TL3305BF260QG-E-Switch-datasheet-62330036.pdf?src-supplier=Future+Electronics; ComponentLink2Description: https://datasheet.octopart.com/TL3305BF260QG-E-Switch-datasheet-62330036.pdf?src-supplier=Future+Electronics; ComponentLink3URL: https://sten-eswitch-13110800-production.s3.amazonaws.com/system/asset/product_line/data_sheet/213/TL3305.pdf?src-supplier=Digikey; ComponentLink3Description: https://sten-eswitch-13110800-production.s3.amazonaws.com/system/asset/product_line/data_sheet/213/TL3305.pdf?src-supplier=Digikey; ComponentLink4URL: http://spec_sheets.e-switch.com/specs/P010472.pdf?src-supplier=Digikey; ComponentLink4Description: http://spec_sheets.e-switch.com/specs/P010472.pdf?src-supplier=Digikey; ComponentLink5URL: https://datasheet.octopart.com/TL3305BF260QG-E-Switch-datasheet-100437264.pdf?src-supplier=Element14; ComponentLink5Description: https://datasheet.octopart.com/TL3305BF260QG-E-Switch-datasheet-100437264.pdf?src-supplier=Element14; ComponentLink6URL: http://www.farnell.com/datasheets/2554191.pdf?src-supplier=Newark; ComponentLink6Description: http://www.farnell.com/datasheets/2554191.pdf?src-supplier=Newark; Supplier Part Number 1: 612-TL3305BF260QG
U?#1 = STM32F103C8T6: ARM Cortex-M3 STM32 F1 Microcontroller 32-Bit 72MHz 64kB FLASH LQFP48 STM32F103C8T6; Manufacturer: STMicroelectronics; RAM Size: 20KB; Interface: I2C,SPI,USB,CAN,USART; Number of I/Os: 37; Number of Timers/Counters: 3; Max Supply Voltage: 3.6V; Number of ADC Channels: 10; Min Supply Voltage: 2V; Data Bus Width: 32b; Nominal Supply Current: 1.7uA; Number of A/D Converters: 2NUMBER; Number of Channels: 10NUMBER; Supplier 1: Digikey; Manufacturer Part Number: STM32F103C8T6; RoHS: Yes; Category: Microcontrollers; Stock 1: 2840; Pricing 1: 1=6,08, 10=4,662, 25=4,3084, 80=3,972, 250=3,73372, 500=3,6219, 1000=3,5299, 2500=3,43276 (USD); Case/Package: LQFP; Number of Pins: 48; Weight: 0.006349oz; Min Operating Temperature: -40°C; Max Operating Temperature: 85°C; Packaging: Tray; Package Quantity: 1500; Memory Type: FLASH; Max Frequency: 72MHz; Memory Size: 64KB; Core Architecture: ARM; Series: STM32F103C8; Length: 7mm; Width: 7mm; Height: 1.4mm; Lead Free: 5697LeadFree; RoHS Compliant: Yes; ComponentLink1URL: https://datasheet.ciiva.com/15122/getdatasheetpartid-69880-15122076.pdf?src-supplier=Verical; ComponentLink1Description: https://datasheet.ciiva.com/15122/getdatasheetpartid-69880-15122076.pdf?src-supplier=Verical; ComponentLink2URL: https://datasheet.ciiva.com/14100/pustm-arm-microcont-stm32f103-en-14100508.pdf?src-supplier=Distrelec; ComponentLink2Description: https://datasheet.ciiva.com/14100/pustm-arm-microcont-stm32f103-en-14100508.pdf?src-supplier=Distrelec; ComponentLink3URL: https://datasheet.ciiva.com/16210/cd00161566-16210248.pdf?src-supplier=Future+Electronics; ComponentLink3Description: https://datasheet.ciiva.com/16210/cd00161566-16210248.pdf?src-supplier=Future+Electronics; ComponentLink4URL: https://datasheet.ciiva.com/8054/1730126-8054942.pdf?src-supplier=Element14; ComponentLink4Description: https://datasheet.ciiva.com/8054/1730126-8054942.pdf?src-supplier=Element14; ComponentLink5URL: https://datasheet.ciiva.com/48687/001075658-da-01-en-mcu-64kb-mem-stm32f103c8t6-lqfp-48-stm-48687589.pdf?src-supplier=Conrad; ComponentLink5Description: https://datasheet.ciiva.com/48687/001075658-da-01-en-mcu-64kb-mem-stm32f103c8t6-lqfp-48-stm-48687589.pdf?src-supplier=Conrad; Supplier Part Number 1: 497-6063-ND
U?#2 = USB PROTECTION: ESD Suppressor Diode Array Dual Uni-Dir 15kV Air Gap/15kV Contact Disc 6-Pin SOT-23 T/R; Manufacturer: STMicroelectronics; Direction: Unidirectional,Bidirectional; Capacitance: 3.5pF; Operating Supply Voltage: 1.1V; Number of Channels: 2; Breakdown Voltage: 6V; Clamping Voltage: 17V; Reverse Standoff Voltage: 5.25V; Power Line Protection: Yes; Test Current: 1mA; Max Reverse Leakage Current: 150nA; Peak Pulse Current: 5A; Data Rate: 480Mbps; Number of Elements: 1; Working Voltage: 5V; Supplier 1: Arrow Electronics; Manufacturer Part Number: USBLC6-2SC6; RoHS: Yes; Category: TVS Diodes; Stock 1: 246000; Pricing 1: 3000=0,0728, 6000=0,0728 (USD); Mount: Surface Mount; Case/Package: SOT-23; Number of Pins: 6; Min Operating Temperature: -40°C; Max Operating Temperature: 125°C; Packaging: Tape and Reel; Package Quantity: 3000; Termination: SMD/SMT; Number of Bidirectional Channels: 2; Min Breakdown Voltage: 6V; ESD Protection: Yes; Leakage Current: 150nA; Series: USB; Reverse Breakdown Voltage: 6V; Polarity: Unidirectional,Bidirectional; Max Breakdown Voltage: 6V; Clamping Voltage-Max: 17V; Max Repetitive Reverse Voltage (Vrrm): 5.25V; Length: 3.05mm; Width: 1.75mm; Height: 1.3mm; Depth: 1.75mm; Radiation Hardening: No; Lead Free: Lead Free; Reach SVHC Compliant: No; RoHS Compliant: Yes; ComponentLink1URL: https://datasheet.ciiva.com/1268/1690354-1268384.pdf?src-supplier=Element14; ComponentLink1Description: https://datasheet.ciiva.com/1268/1690354-1268384.pdf?src-supplier=Element14; ComponentLink2URL: https://datasheet.ciiva.com/4508/cd00050750-113117-4508433.pdf?src-supplier=Mouser; ComponentLink2Description: https://datasheet.ciiva.com/4508/cd00050750-113117-4508433.pdf?src-supplier=Mouser; ComponentLink3URL: https://datasheet.ciiva.com/15143/getdatasheetpartid-148465-15143789.pdf?src-supplier=Verical; ComponentLink3Description: https://datasheet.ciiva.com/15143/getdatasheetpartid-148465-15143789.pdf?src-supplier=Verical; ComponentLink4URL: https://datasheet.ciiva.com/16200/cd00050750-16200026.pdf?src-supplier=Future+Electronics; ComponentLink4Description: https://datasheet.ciiva.com/16200/cd00050750-16200026.pdf?src-supplier=Future+Electronics; ComponentLink5URL: https://datasheet.ciiva.com/41444/001184109-da-01-en-ic-esd-protecti-usblc6-2sc6-sot-23-6-stm-41444156.pdf?src-supplier=Conrad; ComponentLink5Description: https://datasheet.ciiva.com/41444/001184109-da-01-en-ic-esd-protecti-usblc6-2sc6-sot-23-6-stm-41444156.pdf?src-supplier=Conrad; Supplier Part Number 1: USBLC6-2SC6
X?#1 = CRYSTAL 32.768kHz: Crystal 0.032768MHz ±20ppm (Tol) 6pF Flexural 80000Ohm Automotive 2-Pin Mini-CSMD T/R; Manufacturer: Abracon; Manufacturer Part Number: ABS07AIG-32.768KHZ-6-T; Supplier 1: Mouser; RoHS: Yes; Category: Crystals; Stock 1: 4596; Pricing 1: 1=0,56, 10=0,491, 50=0,445, 100=0,427, 1000=0,371, 10000=0,3 (USD); ComponentLink1URL: https://www.digikey.com/en/products/detail/abracon-llc/ABS07AIG-32-768KHZ-6-T/5817551?s=N4IgTCBcDaIIICEDKAGA7HAkgcQLQGYwA6NANgA4BpACQC1dTcAVEAXQF8g; ComponentLink1Description: Purchasing; Supplier Part Number 1: 815-S07AIG-32.768-6T
X?#2 = CRYSTAL 8MHz: Crystal 8MHz ±30ppm (Tol) ±35ppm (Stability) 16pF FUND 80Ohm 2-Pin HC-49/US SMD T/R; Manufacturer: Abracon; Manufacturer Part Number: ABLS-8.000MHZ-16-A-4-H-T; Supplier 1: Mouser; RoHS: Yes; Category: Crystals; Stock 1: 2382; Pricing 1: 1=0,25, 10=0,217, 50=0,198, 100=0,189, 1000=0,171, 10000=0,107 (USD); ComponentLink1URL: https://abracon.com/Resonators/abls.pdf?src-supplier=Digikey; ComponentLink1Description: https://abracon.com/Resonators/abls.pdf?src-supplier=Digikey; Supplier Part Number 1: 815-LS8000MHZ16A4HT